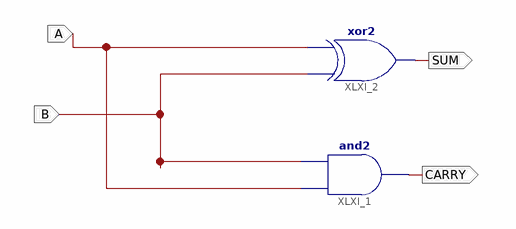
[diagram p0: schematic sheet 1]
// Xilinx ISE schematic halfAdder.sch (artix7) as structural Verilog: 2 symbols, 4 ports
module halfAdder (
  input  B,
  input  A,
  output SUM,
  output CARRY
);

  and XLXI_1 (CARRY, A, B);
  xor XLXI_2 (SUM, B, A);
endmodule
